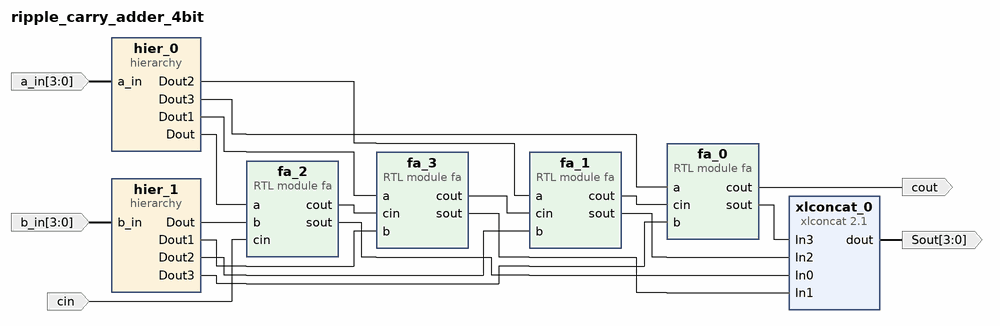
[diagram p0: block diagram of the top level]
# Vivado block design ripple_carry_adder_4bit, xc7z010clg400-1, Vivado 2019.1
create_bd_design ripple_carry_adder_4bit

create_bd_port -dir I -from 3 -to 0 a_in
create_bd_port -dir I -from 3 -to 0 b_in
create_bd_port -dir O cout
create_bd_port -dir O -from 3 -to 0 Sout
create_bd_port -dir I cin

create_bd_cell -type module -reference fa fa_0
create_bd_cell -type module -reference fa fa_1
create_bd_cell -type module -reference fa fa_2
create_bd_cell -type module -reference fa fa_3
create_bd_cell -type hier hier_0
create_bd_cell -type hier hier_1
create_bd_cell -type ip -vlnv xilinx.com:ip:xlconcat:2.1 xlconcat_0
set_property -dict {CONFIG.NUM_PORTS 4} [get_bd_cells xlconcat_0]

# ---- hierarchy /hier_0 ----
current_bd_instance /hier_0
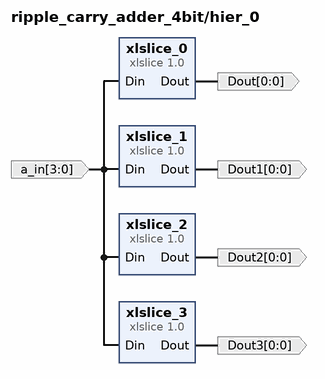
[diagram p1: block diagram inside /hier_0]
create_bd_pin -dir I -from 3 -to 0 a_in
create_bd_pin -dir O -from 0 -to 0 Dout
create_bd_pin -dir O -from 0 -to 0 Dout1
create_bd_pin -dir O -from 0 -to 0 Dout2
create_bd_pin -dir O -from 0 -to 0 Dout3

create_bd_cell -type ip -vlnv xilinx.com:ip:xlslice:1.0 xlslice_0
set_property -dict {CONFIG.DIN_FROM 0 CONFIG.DIN_TO 0 CONFIG.DIN_WIDTH 4} [get_bd_cells xlslice_0]
create_bd_cell -type ip -vlnv xilinx.com:ip:xlslice:1.0 xlslice_1
set_property -dict {CONFIG.DIN_FROM 1 CONFIG.DIN_TO 1 CONFIG.DIN_WIDTH 4 CONFIG.DOUT_WIDTH 1} [get_bd_cells xlslice_1]
create_bd_cell -type ip -vlnv xilinx.com:ip:xlslice:1.0 xlslice_2
set_property -dict {CONFIG.DIN_FROM 2 CONFIG.DIN_TO 2 CONFIG.DIN_WIDTH 4 CONFIG.DOUT_WIDTH 1} [get_bd_cells xlslice_2]
create_bd_cell -type ip -vlnv xilinx.com:ip:xlslice:1.0 xlslice_3
set_property -dict {CONFIG.DIN_FROM 3 CONFIG.DIN_TO 3 CONFIG.DIN_WIDTH 4 CONFIG.DOUT_WIDTH 1} [get_bd_cells xlslice_3]

# ---- hierarchy /hier_1 ----
current_bd_instance /hier_1
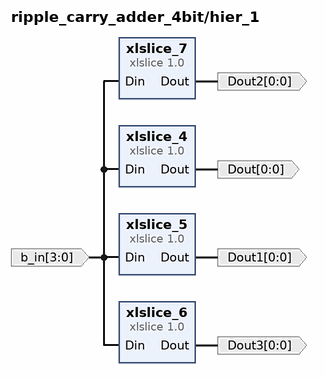
[diagram p2: block diagram inside /hier_1]
create_bd_pin -dir I -from 3 -to 0 b_in
create_bd_pin -dir O -from 0 -to 0 Dout
create_bd_pin -dir O -from 0 -to 0 Dout1
create_bd_pin -dir O -from 0 -to 0 Dout2
create_bd_pin -dir O -from 0 -to 0 Dout3

create_bd_cell -type ip -vlnv xilinx.com:ip:xlslice:1.0 xlslice_4
set_property -dict {CONFIG.DIN_FROM 0 CONFIG.DIN_TO 0 CONFIG.DIN_WIDTH 4} [get_bd_cells xlslice_4]
create_bd_cell -type ip -vlnv xilinx.com:ip:xlslice:1.0 xlslice_5
set_property -dict {CONFIG.DIN_FROM 1 CONFIG.DIN_TO 1 CONFIG.DIN_WIDTH 4 CONFIG.DOUT_WIDTH 1} [get_bd_cells xlslice_5]
create_bd_cell -type ip -vlnv xilinx.com:ip:xlslice:1.0 xlslice_7
set_property -dict {CONFIG.DIN_FROM 3 CONFIG.DIN_TO 3 CONFIG.DIN_WIDTH 4 CONFIG.DOUT_WIDTH 1} [get_bd_cells xlslice_7]
create_bd_cell -type ip -vlnv xilinx.com:ip:xlslice:1.0 xlslice_6
set_property -dict {CONFIG.DIN_FROM 2 CONFIG.DIN_TO 2 CONFIG.DIN_WIDTH 4 CONFIG.DOUT_WIDTH 1} [get_bd_cells xlslice_6]

# ---- connections ----

current_bd_instance /hier_0
connect_bd_net [get_bd_pins a_in] [get_bd_pins xlslice_1/Din] [get_bd_pins xlslice_2/Din] [get_bd_pins xlslice_3/Din] [get_bd_pins xlslice_0/Din]
connect_bd_net [get_bd_pins xlslice_0/Dout] [get_bd_pins Dout]
connect_bd_net [get_bd_pins xlslice_1/Dout] [get_bd_pins Dout1]
connect_bd_net [get_bd_pins xlslice_2/Dout] [get_bd_pins Dout2]
connect_bd_net [get_bd_pins xlslice_3/Dout] [get_bd_pins Dout3]

current_bd_instance /hier_1
connect_bd_net [get_bd_pins b_in] [get_bd_pins xlslice_5/Din] [get_bd_pins xlslice_7/Din] [get_bd_pins xlslice_6/Din] [get_bd_pins xlslice_4/Din]
connect_bd_net [get_bd_pins xlslice_4/Dout] [get_bd_pins Dout]
connect_bd_net [get_bd_pins xlslice_5/Dout] [get_bd_pins Dout1]
connect_bd_net [get_bd_pins xlslice_7/Dout] [get_bd_pins Dout2]
connect_bd_net [get_bd_pins xlslice_6/Dout] [get_bd_pins Dout3]

current_bd_instance /
connect_bd_net [get_bd_pins fa_2/cout] [get_bd_pins fa_3/cin]
connect_bd_net [get_bd_pins fa_3/cout] [get_bd_pins fa_1/cin]
connect_bd_net [get_bd_pins fa_1/cout] [get_bd_pins fa_0/cin]
connect_bd_net [get_bd_ports a_in] [get_bd_pins hier_0/a_in]
connect_bd_net -net xlslice_0_Dout [get_bd_pins hier_0/Dout] [get_bd_pins fa_2/a]
connect_bd_net -net xlslice_1_Dout [get_bd_pins hier_0/Dout1] [get_bd_pins fa_3/a]
connect_bd_net -net xlslice_2_Dout [get_bd_pins hier_0/Dout2] [get_bd_pins fa_1/a]
connect_bd_net -net xlslice_3_Dout [get_bd_pins hier_0/Dout3] [get_bd_pins fa_0/a]
connect_bd_net [get_bd_ports b_in] [get_bd_pins hier_1/b_in]
connect_bd_net -net xlslice_4_Dout [get_bd_pins hier_1/Dout] [get_bd_pins fa_2/b]
connect_bd_net -net xlslice_5_Dout [get_bd_pins hier_1/Dout1] [get_bd_pins fa_3/b]
connect_bd_net -net xlslice_7_Dout [get_bd_pins hier_1/Dout2] [get_bd_pins fa_1/b]
connect_bd_net -net xlslice_6_Dout [get_bd_pins hier_1/Dout3] [get_bd_pins fa_0/b]
connect_bd_net [get_bd_pins fa_2/sout] [get_bd_pins xlconcat_0/In0]
connect_bd_net [get_bd_pins fa_3/sout] [get_bd_pins xlconcat_0/In1]
connect_bd_net [get_bd_pins fa_1/sout] [get_bd_pins xlconcat_0/In2]
connect_bd_net [get_bd_pins fa_0/sout] [get_bd_pins xlconcat_0/In3]
connect_bd_net [get_bd_pins fa_0/cout] [get_bd_ports cout]
connect_bd_net [get_bd_pins xlconcat_0/dout] [get_bd_ports Sout]
connect_bd_net -net cin_0_1 [get_bd_ports cin] [get_bd_pins fa_2/cin]

validate_bd_design
save_bd_design
